# Altium project LTE-GNSS Asset Tracker.PrjPcb (part 1 of 3)
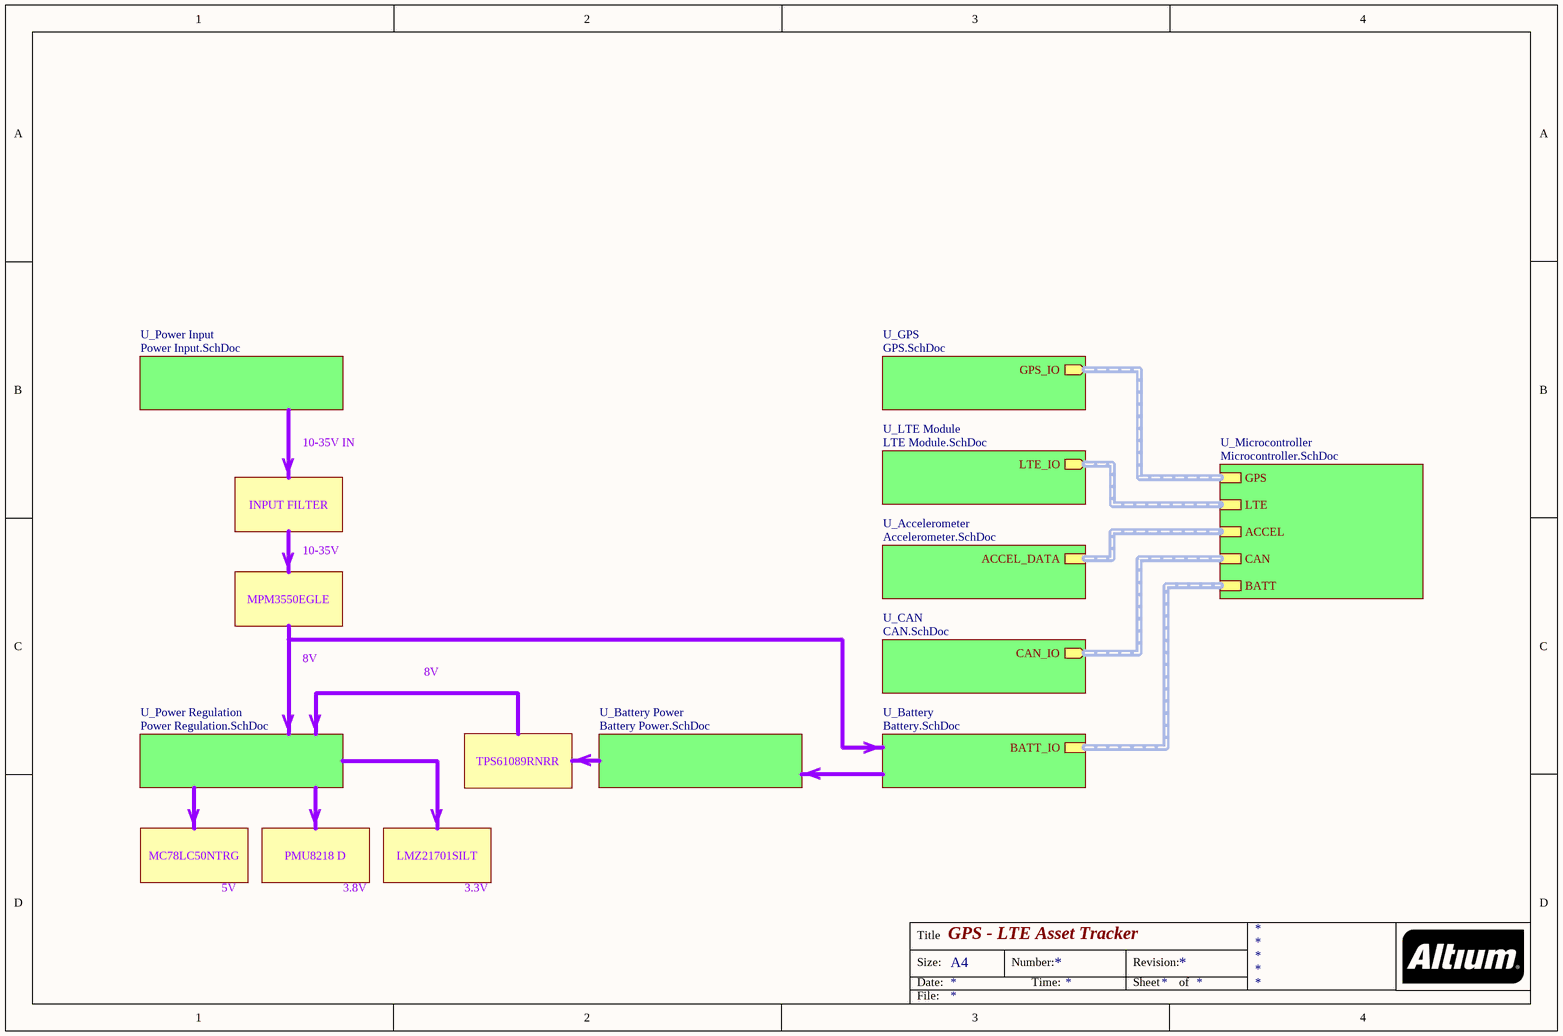
[diagram p0: Top.SchDoc]
10 sheets, 140 parts. Net scope: hierarchical (ports join the sheet entries above them; power ports are global).
Board file: LTE GNSS Tracker.PcbDoc
Sheets:
  Top.SchDoc
    U_Power Regulation = Power Regulation.SchDoc
    U_Power Input = Power Input.SchDoc
    U_Battery = Battery.SchDoc
    U_CAN = CAN.SchDoc
    U_LTE Module = LTE Module.SchDoc
    U_GPS = GPS.SchDoc
    U_Accelerometer = Accelerometer.SchDoc
    U_Battery Power = Battery Power.SchDoc
    U_Microcontroller = Microcontroller.SchDoc

## Sheet Top.SchDoc: GPS - LTE Asset Tracker
size A4; Engineer: Mark Harris

### Sub-sheets
U_Accelerometer = Accelerometer.SchDoc: ACCEL_DATA (harness ACCEL)
U_Battery = Battery.SchDoc: BATT_IO (harness BATT)
U_Battery Power = Battery Power.SchDoc: no entries
U_CAN = CAN.SchDoc: CAN_IO (out, harness CAN)
U_GPS = GPS.SchDoc: GPS_IO (out, harness GPS)
U_LTE Module = LTE Module.SchDoc: LTE_IO (out, harness LTE)
U_Microcontroller = Microcontroller.SchDoc: ACCEL (harness ACCEL), CAN (harness CAN), GPS (harness GPS), LTE (harness LTE), BATT (harness BATT)
U_Power Input = Power Input.SchDoc: no entries
U_Power Regulation = Power Regulation.SchDoc: no entries

### Buses and harness runs
harness sheet U_Accelerometer/ACCEL_DATA = sheet U_Microcontroller/ACCEL
harness sheet U_Battery/BATT_IO = sheet U_Microcontroller/BATT
harness sheet U_CAN/CAN_IO = sheet U_Microcontroller/CAN
harness sheet U_GPS/GPS_IO = sheet U_Microcontroller/GPS
harness sheet U_LTE Module/LTE_IO = sheet U_Microcontroller/LTE

### Notes on the sheet
- 10-35V IN
- INPUT FILTER
- V
- 10-35V
- MPM3550EGLE
- 8V
- TPS61089RNRR
- MC78LC50NTRG
- PMU8218 D
- LMZ21701SILT
- 5V
- 3.8V
- 3.3V
- Title
- Size:
- Date:
- A4
- Number:
- Time:
- Revision:
- Sheet
- of
- File:

## Sheet Power Regulation.SchDoc
size A4
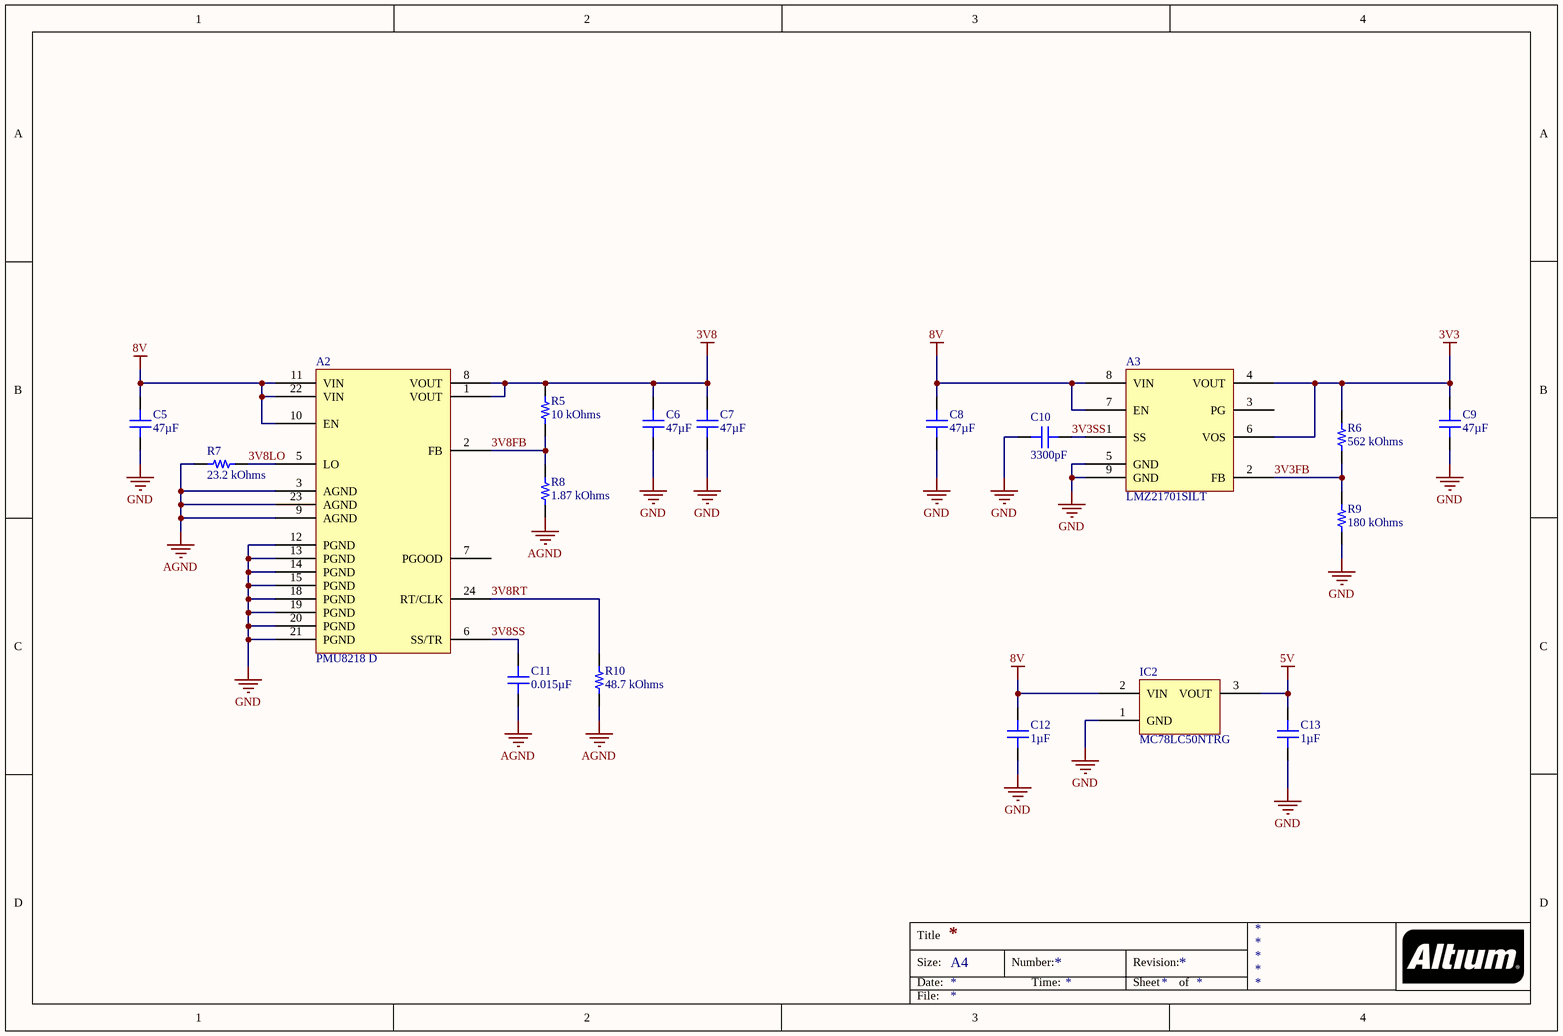
[diagram p1: Power Regulation.SchDoc]

### Parts
A2  PMU8218 D  [FLEX QFM-24 MOL]
A3  LMZ21701SILT  [TI MICROSIP-8 SIL0008E]
C5  47µF  [CAP 1210_3225 - 2.8MM]
C6  47µF  [CAP 1210_3225 - 2.8MM]
C7  47µF  [CAP 1210_3225 - 2.8MM]
C8  47µF  [CAP 1210_3225 - 2.8MM]
C9  47µF  [CAP 1210_3225 - 2.8MM]
C10  3300pF  [CAP 0201_0603]
C11  0.015µF  [CAP 0201_0603]
C12  1µF  [CAP 0402_1005]
C13  1µF  [CAP 0402_1005]
IC2  MC78LC50NTRG  [ON SEMI TSOT-23-5 419AE]
R5  10 kOhms  [RES 0201_0603]
R6  562 kOhms  [RES 0201_0603]
R7  23.2 kOhms  [RES 0201_0603]
R8  1.87 kOhms  [RES 0201_0603]
R9  180 kOhms  [RES 0201_0603]
R10  48.7 kOhms  [RES 0201_0603]

### Nets
3V3: A3.4(VOUT) A3.6(VOS) C9.2 R6.2
3V8: A2.1(VOUT) A2.8(VOUT) C6.2 C7.2 R5.2
5V: C13.2 IC2.3(VOUT)
8V: A2.10(EN) A2.11(VIN) A2.22(VIN) A3.7(EN) A3.8(VIN) C5.2 C8.2 C12.2 IC2.2(VIN)
AGND: A2.3(AGND) A2.9(AGND) A2.23(AGND) C11.1 R7.1 R8.1 R10.1
GND: A2.12(PGND) A2.13(PGND) A2.14(PGND) A2.15(PGND) A2.18(PGND) A2.19(PGND) A2.20(PGND) A2.21(PGND) A3.5(GND) A3.9(GND) C5.1 C6.1 C7.1 C8.1 C9.1 C10.1 C12.1 C13.1 IC2.1(GND) R9.1
3V3FB: A3.2(FB) R6.1 R9.2
3V3SS: A3.1(SS) C10.2
3V8FB: A2.2(FB) R5.1 R8.2
3V8LO: A2.5(LO) R7.2
3V8RT: A2.24(RT/CLK) R10.2
3V8SS: A2.6(SS/TR) C11.2

Not connected (* = marked no-connect by the designer): A2 7(PGOOD); A3 3(PG)

### Notes on the sheet
- Title
- Size:
- Date:
- A4
- Number:
- Time:
- Revision:
- Sheet
- of
- File:

### Library data of the parts
A2 = PMU8218 D: ANALOG POL; 4.5-17VIN; 0.6-5.5VO; Manufacturer: Flex Power Modules; Control Features: Enable, Active High; Current - Output (Max): 4A; Efficiency: 88.5%; Number of Outputs: 1; Power (Watts): 22W; Voltage - Input (Max): 17V; Voltage - Input (Min): 4.5V; Voltage - Output 1: 0.6 ~ 5.5V; Part Number: PMU8218 D; Applications: ITE (Commercial); ComponentLink1Description: Datasheet; ComponentLink1URL: https://flex.com/-/media/Project/Flex/BrandSite/technology/power/power_modules/Analog_POL/FPM-TechSpec-PMU-product-series-RevB.pdf; ComponentLink2Description: DigiKey Link; ComponentLink2URL: http://digikey.com/product-detail/en/flex-power-modules/PMU8218-D/2166-PMU8218DCT-ND/11581978; Device Package: 24-SMD Module; Features: Adjustable Output, Remote On/Off; LastUpdated: 04/04/2020 18:59:44; Lifecycle Status: Active; Minimum Order: 1; Mounting Type: Surface Mount; Operating Temperature: -40°C ~ 125°C; Package / Case: 24-SMD Module; Packaging: Unknown; PartId: 24; Part Status: Active; Price: 4.46; Series: PMU8000; Size / Dimension: 0.30" L x 0.30" W x 0.21" H (7.5mm x 7.5mm x 5.4mm); Supplier 1: DigiKey; Supplier Part Number 1: 2166-PMU8218DCT-ND; Type: Non-Isolated PoL Module
A3 = LMZ21701SILT: DC DC CONVERTER 0.9-6V 6W; Manufacturer: Texas Instruments; Control Features: Enable, Active High; Current - Output (Max): 1A; Efficiency: 95%; Number of Outputs: 1; Voltage - Input (Max): 17V; Voltage - Input (Min): 3V; Voltage - Output 1: 0.9 ~ 6V; Part Number: LMZ21701SILT; Applications: ITE (Commercial); ComponentLink1Description: Datasheet; ComponentLink1URL: http://www.ti.com/general/docs/suppproductinfo.tsp?distId=10&gotoUrl=http%3A%2F%2Fwww.ti.com%2Flit%2Fgpn%2Flmz21701; ComponentLink2Description: DigiKey Link; ComponentLink2URL: //digikey.com/product-detail/en/texas-instruments/LMZ21701SILT/296-38545-2-ND/5034142; Device Package: 8-SMD Module; Features: OCP, OTP, SCP, UVLO; LastUpdated: 12/12/2019 07:43:20; Lifecycle Status: 0; Minimum Order: 1; Mounting Type: Surface Mount; Operating Temperature: -40°C ~ 125°C; Package / Case: 8-SMD Module; Packaging: TapeAndReel; PartId: 15; Part Status: Active; Price: 2.94; Series: SIMPLE SWITCHER® Nano; Size / Dimension: 0.14" L x 0.14" W x 0.07" H (3.5mm x 3.5mm x 1.8mm); Supplier 1: DigiKey; Supplier Part Number 1: 296-38545-2-ND; Type: Non-Isolated PoL Module
C5-C9 = LMK325B7476MM-PR: CAP CER 47UF 10V X7R 1210; Manufacturer: Taiyo Yuden; Tolerance: ±20%; Part Number: LMK325B7476MM-PR; Value: 47µF; Applications: General Purpose; Capacitance: 47µF; ComponentLink1Description: Datasheet; ComponentLink1URL: https://www.yuden.co.jp/productdata/catalog/mlcc01_e.pdf; ComponentLink2Description: DigiKey Link; ComponentLink2URL: http://digikey.com/product-detail/en/taiyo-yuden/LMK325B7476MM-PR/587-5922-1-ND/7675042; Device Package: 1210 (3225 Metric); LastUpdated: 21/01/2020 00:30:21; Lifecycle Status: Active; Minimum Order: 1; Mounting Type: Surface Mount, MLCC; Operating Temperature: -55°C ~ 125°C; Package / Case: 1210 (3225 Metric); Packaging: TapeAndReel; PartId: 24091; Part Status: Active; Price: 0.28; Series: M; Size / Dimension: 0.126" L x 0.098" W (3.20mm x 2.50mm); Supplier 1: DigiKey; Supplier Part Number 1: 587-5922-1-ND; Temperature Coefficient: X7R; Thickness (Max): 0.106" (2.70mm); Voltage - Rated: 10V
C10 = GRM033R70J332KA01D: CAP CER 3300PF 6.3V X7R 0201; Manufacturer: Murata Electronics; Tolerance: ±10%; Part Number: GRM033R70J332KA01D; Value: 3300pF; Applications: General Purpose; Capacitance: 3300pF; ComponentLink1Description: Datasheet; ComponentLink1URL: https://www.murata.com/~/media/webrenewal/support/library/catalog/products/capacitor/mlcc/c02e.ashx?la=en-us; ComponentLink2Description: DigiKey Link; ComponentLink2URL: http://digikey.com/product-detail/en/murata-electronics/GRM033R70J332KA01D/490-8158-1-ND/4380451; Device Package: 0201 (0603 Metric); LastUpdated: 21/01/2020 00:00:13; Lifecycle Status: Active; Minimum Order: 1; Mounting Type: Surface Mount, MLCC; Operating Temperature: -55°C ~ 125°C; Package / Case: 0201 (0603 Metric); Packaging: CutTape; PartId: 1379; Part Status: Active; Price: 0.10; Series: GRM; Size / Dimension: 0.024" L x 0.012" W (0.60mm x 0.30mm); Supplier 1: DigiKey; Supplier Part Number 1: 490-8158-1-ND; Temperature Coefficient: X7R; Thickness (Max): 0.013" (0.33mm); Voltage - Rated: 6.3V
C11 = CC0201KRX5R5BB153: CAP CER 0.015UF 6.3V X5R 0201; Manufacturer: Yageo; Tolerance: ±10%; Part Number: CC0201KRX5R5BB153; Value: 0.015µF; Applications: General Purpose; Capacitance: 0.015µF; ComponentLink1Description: Datasheet; ComponentLink1URL: https://www.yageo.com/upload/media/product/productsearch/datasheet/mlcc/UPY-GPHC_X5R_4V-to-50V_25.pdf; ComponentLink2Description: DigiKey Link; ComponentLink2URL: http://digikey.com/product-detail/en/yageo/CC0201KRX5R5BB153/311-3686-1-ND/8024775; Device Package: 0201 (0603 Metric); LastUpdated: 21/01/2020 00:00:12; Lifecycle Status: Active; Minimum Order: 1; Mounting Type: Surface Mount, MLCC; Operating Temperature: -55°C ~ 85°C; Package / Case: 0201 (0603 Metric); Packaging: TapeAndReel; PartId: 1637; Part Status: Active; Price: 0.01; Series: CC; Size / Dimension: 0.024" L x 0.012" W (0.60mm x 0.30mm); Supplier 1: DigiKey; Supplier Part Number 1: 311-3686-1-ND; Temperature Coefficient: X5R; Thickness (Max): 0.013" (0.33mm); Voltage - Rated: 6.3V
C12 C13 = GRM155R61C105MA12D: CAP CER 1UF 16V X5R 0402; Manufacturer: Murata Electronics; Tolerance: ±20%; Part Number: GRM155R61C105MA12D; Value: 1µF; Applications: General Purpose; Capacitance: 1µF; ComponentLink1Description: Datasheet; ComponentLink1URL: https://search.murata.co.jp/Ceramy/image/img/A01X/G101/ENG/GRM155R61C105MA12-01.pdf; ComponentLink2Description: DigiKey Link; ComponentLink2URL: http://digikey.com/product-detail/en/murata-electronics/GRM155R61C105MA12D/490-14599-1-ND/6606205; Device Package: 0402 (1005 Metric); LastUpdated: 01/04/2020 23:56:41; Lifecycle Status: Active; Minimum Order: 1; Mounting Type: Surface Mount, MLCC; Operating Temperature: -55°C ~ 85°C; Package / Case: 0402 (1005 Metric); Packaging: TapeAndReel; PartId: 10295; Part Status: Active; Price: 0.01; Series: GRM; Size / Dimension: 0.039" L x 0.020" W (1.00mm x 0.50mm); Supplier 1: DigiKey; Supplier Part Number 1: 490-14599-1-ND; Temperature Coefficient: X5R; Thickness (Max): 0.022" (0.55mm); Voltage - Rated: 16V
IC2 = MC78LC50NTRG: IC REG LINEAR 5V 100MA 5TSOP; Manufacturer: ON Semiconductor; Current - Quiescent (Iq): 3.6µA; Number of Regulators: 1; Output Configuration: Positive; Output Type: Fixed; Voltage Dropout (Max): 0.038V @ 1mA; Voltage - Input (Max): 12V; Part Number: MC78LC50NTRG; ComponentLink1Description: Datasheet; ComponentLink1URL: http://www.onsemi.com/pub/Collateral/MC78LC00-D.PDF; ComponentLink2Description: DigiKey Link; ComponentLink2URL: http://digikey.com/product-detail/en/on-semiconductor/MC78LC50NTRG/MC78LC50NTRGOSCT-ND/1139754; Current - Output: 100mA; Device Package: SOT-23-5 Thin, TSOT-23-5; LastUpdated: 21/01/2020 03:58:44; Lifecycle Status: Active; Minimum Order: 1; Mounting Type: Surface Mount; Operating Temperature: -40°C ~ 85°C; Package / Case: SOT-23-5 Thin, TSOT-23-5; Packaging: TapeAndReel; Part Status: Active; Price: 0.28; Series: -; Supplier 1: DigiKey; Supplier Part Number 1: MC78LC50NTRGOSCT-ND; Supplier Device Package: 5-TSOP; Voltage - Output (Min/Fixed): 5V
R5 = ERJ-1GNF1002C: RES SMD 10K OHM 1% 1/20W 0201; Manufacturer: Panasonic Electronic Components; Power (Watts): 0.05W, 1/20W; Temperature Coefficient: ±200ppm/°C; Part Number: ERJ-1GNF1002C; Value: 10 kOhms; ComponentLink1Description: Datasheet; ComponentLink1URL: https://industrial.panasonic.com/cdbs/www-data/pdf/RDA0000/AOA0000C304.pdf; ComponentLink2Description: DigiKey Link; ComponentLink2URL: http://digikey.com/product-detail/en/panasonic-electronic-components/ERJ-1GNF1002C/P122414CT-ND/7389440; Composition: Thick Film; Device Package: 0201 (0603 Metric); Features: Automotive AEC-Q200; Height - Seated (Max): 0.010" (0.26mm); LastUpdated: 21/01/2020 00:04:13; Lifecycle Status: Active; Minimum Order: 1; Number of Terminations: 2; Operating Temperature: -55°C ~ 125°C; Package / Case: 0201 (0603 Metric); Packaging: TapeAndReel; PartId: 2296; Part Status: Active; Price: 0.01; Ratings: AEC-Q200; Resistance: 10 kOhms; Series: ERJ; Size / Dimension: 0.024" L x 0.012" W (0.60mm x 0.30mm); Supplier 1: DigiKey; Supplier Part Number 1: P122414CT-ND; Supplier Device Package: 0201; Tolerance: ±1%
R6 = ERJ-1GNF5623C: RES SMD 562K OHM 1% 1/20W 0201; Manufacturer: Panasonic Electronic Components; Power (Watts): 0.05W, 1/20W; Temperature Coefficient: ±200ppm/°C; Part Number: ERJ-1GNF5623C; Value: 562 kOhms; ComponentLink1Description: Datasheet; ComponentLink1URL: https://industrial.panasonic.com/cdbs/www-data/pdf/RDA0000/AOA0000C304.pdf; ComponentLink2Description: DigiKey Link; ComponentLink2URL: http://digikey.com/product-detail/en/panasonic-electronic-components/ERJ-1GNF5623C/P123081CT-ND/8343101; Composition: Thick Film; Device Package: 0201 (0603 Metric); Features: Automotive AEC-Q200; Height - Seated (Max): 0.010" (0.26mm); LastUpdated: 21/01/2020 00:04:13; Lifecycle Status: Active; Minimum Order: 1; Number of Terminations: 2; Operating Temperature: -55°C ~ 125°C; Package / Case: 0201 (0603 Metric); Packaging: TapeAndReel; PartId: 2605; Part Status: Active; Price: 0.01; Ratings: AEC-Q200; Resistance: 562 kOhms; Series: ERJ; Size / Dimension: 0.024" L x 0.012" W (0.60mm x 0.30mm); Supplier 1: DigiKey; Supplier Part Number 1: P123081CT-ND; Supplier Device Package: 0201; Tolerance: ±1%
R7 = ERJ-1GNF2322C: RES SMD 23.2K OHM 1% 1/20W 0201; Manufacturer: Panasonic Electronic Components; Power (Watts): 0.05W, 1/20W; Temperature Coefficient: ±200ppm/°C; Part Number: ERJ-1GNF2322C; Value: 23.2 kOhms; ComponentLink1Description: Datasheet; ComponentLink1URL: https://industrial.panasonic.com/cdbs/www-data/pdf/RDA0000/AOA0000C304.pdf; ComponentLink2Description: DigiKey Link; ComponentLink2URL: http://digikey.com/product-detail/en/panasonic-electronic-components/ERJ-1GNF2322C/P122848CT-ND/8342635; Composition: Thick Film; Device Package: 0201 (0603 Metric); Features: Automotive AEC-Q200; Height - Seated (Max): 0.010" (0.26mm); LastUpdated: 21/01/2020 00:04:13; Lifecycle Status: Active; Minimum Order: 1; Number of Terminations: 2; Operating Temperature: -55°C ~ 125°C; Package / Case: 0201 (0603 Metric); Packaging: TapeAndReel; PartId: 2324; Part Status: Active; Price: 0.01; Ratings: AEC-Q200; Resistance: 23.2 kOhms; Series: ERJ; Size / Dimension: 0.024" L x 0.012" W (0.60mm x 0.30mm); Supplier 1: DigiKey; Supplier Part Number 1: P122848CT-ND; Supplier Device Package: 0201; Tolerance: ±1%
R8 = ERJ-1GNF1871C: RES SMD 1.87K OHM 1% 1/20W 0201; Manufacturer: Panasonic Electronic Components; Power (Watts): 0.05W, 1/20W; Temperature Coefficient: ±200ppm/°C; Part Number: ERJ-1GNF1871C; Value: 1.87 kOhms; ComponentLink1Description: Datasheet; ComponentLink1URL: https://industrial.panasonic.com/cdbs/www-data/pdf/RDA0000/AOA0000C304.pdf; ComponentLink2Description: DigiKey Link; ComponentLink2URL: http://digikey.com/product-detail/en/panasonic-electronic-components/ERJ-1GNF1871C/P122796CT-ND/8342531; Composition: Thick Film; Device Package: 0201 (0603 Metric); Features: Automotive AEC-Q200; Height - Seated (Max): 0.010" (0.26mm); LastUpdated: 21/01/2020 00:04:11; Lifecycle Status: Active; Minimum Order: 1; Number of Terminations: 2; Operating Temperature: -55°C ~ 125°C; Package / Case: 0201 (0603 Metric); Packaging: TapeAndReel; PartId: 3542; Part Status: Active; Price: 0.01; Ratings: AEC-Q200; Resistance: 1.87 kOhms; Series: ERJ; Size / Dimension: 0.024" L x 0.012" W (0.60mm x 0.30mm); Supplier 1: DigiKey; Supplier Part Number 1: P122796CT-ND; Supplier Device Package: 0201; Tolerance: ±1%
R9 = ERJ-1GNF1803C: RES SMD 180K OHM 1% 1/20W 0201; Manufacturer: Panasonic Electronic Components; Power (Watts): 0.05W, 1/20W; Temperature Coefficient: ±200ppm/°C; Part Number: ERJ-1GNF1803C; Value: 180 kOhms; ComponentLink1Description: Datasheet; ComponentLink1URL: https://industrial.panasonic.com/cdbs/www-data/pdf/RDA0000/AOA0000C304.pdf; ComponentLink2Description: DigiKey Link; ComponentLink2URL: http://digikey.com/product-detail/en/panasonic-electronic-components/ERJ-1GNF1803C/P122790CT-ND/8342519; Composition: Thick Film; Device Package: 0201 (0603 Metric); Features: Automotive AEC-Q200; Height - Seated (Max): 0.010" (0.26mm); LastUpdated: 21/01/2020 00:04:10; Lifecycle Status: Active; Minimum Order: 1; Number of Terminations: 2; Operating Temperature: -55°C ~ 125°C; Package / Case: 0201 (0603 Metric); Packaging: TapeAndReel; PartId: 4229; Part Status: Active; Price: 0.01; Ratings: AEC-Q200; Resistance: 180 kOhms; Series: ERJ; Size / Dimension: 0.024" L x 0.012" W (0.60mm x 0.30mm); Supplier 1: DigiKey; Supplier Part Number 1: P122790CT-ND; Supplier Device Package: 0201; Tolerance: ±1%
R10 = ERJ-1GNF4872C: RES SMD 48.7K OHM 1% 1/20W 0201; Manufacturer: Panasonic Electronic Components; Power (Watts): 0.05W, 1/20W; Temperature Coefficient: ±200ppm/°C; Part Number: ERJ-1GNF4872C; Value: 48.7 kOhms; ComponentLink1Description: Datasheet; ComponentLink1URL: https://industrial.panasonic.com/cdbs/www-data/pdf/RDA0000/AOA0000C304.pdf; ComponentLink2Description: DigiKey Link; ComponentLink2URL: http://digikey.com/product-detail/en/panasonic-electronic-components/ERJ-1GNF4872C/P123042CT-ND/8343023; Composition: Thick Film; Device Package: 0201 (0603 Metric); Features: Automotive AEC-Q200; Height - Seated (Max): 0.010" (0.26mm); LastUpdated: 21/01/2020 00:04:10; Lifecycle Status: Active; Minimum Order: 1; Number of Terminations: 2; Operating Temperature: -55°C ~ 125°C; Package / Case: 0201 (0603 Metric); Packaging: TapeAndReel; PartId: 4173; Part Status: Active; Price: 0.01; Ratings: AEC-Q200; Resistance: 48.7 kOhms; Series: ERJ; Size / Dimension: 0.024" L x 0.012" W (0.60mm x 0.30mm); Supplier 1: DigiKey; Supplier Part Number 1: P123042CT-ND; Supplier Device Package: 0201; Tolerance: ±1%

## Sheet Power Input.SchDoc
size A4
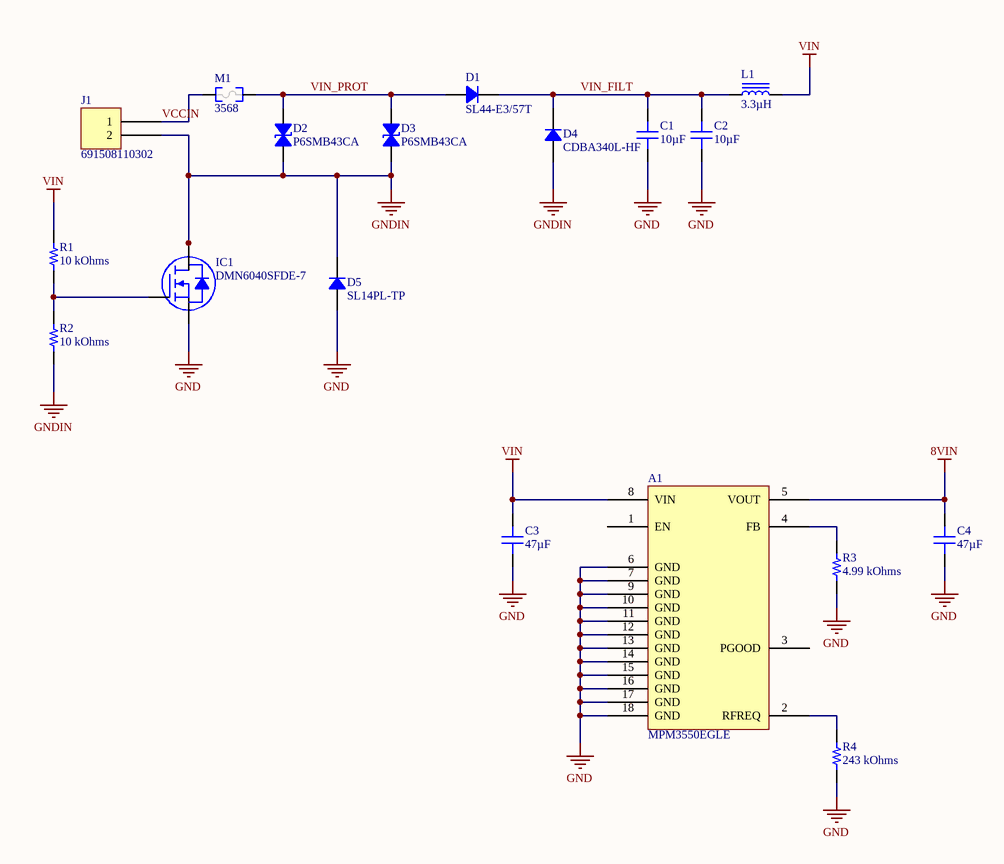
[diagram p2: Power Input.SchDoc]

### Parts
A1  MPM3550EGLE  [MPS LGA-18 12x12x4.2mm]
C1  10µF  [CAP 1210_3225 - 2.8MM]
C2  10µF  [CAP 1210_3225 - 2.8MM]
C3  47µF  [CAP 1210_3225 - 2.8MM]
C4  47µF  [CAP 1210_3225 - 2.8MM]
D1  SL44-E3/57T  [DO214AB SMC]
D2  P6SMB43CA  [DO214AA SMB]
D3  P6SMB43CA  [DO214AA SMB]
D4  CDBA340L-HF  [DO214AC SMA]
D5  SL14PL-TP  [SOD123F]
IC1  DMN6040SFDE-7  [DIODES U-DFN2020-6E]
J1  691508110302  [WURTH 691508110302]
L1  3.3µH  [BOURNS SRP5030T]
M1  3568  [KEYSTONE 3568]
R1  10 kOhms  [RES 0201_0603]
R2  10 kOhms  [RES 0201_0603]
R3  4.99 kOhms  [RES 0201_0603]
R4  243 kOhms  [RES 0201_0603]

### Nets
8VIN: A1.5(VOUT) C4.2
GND: A1.6(GND) A1.7(GND) A1.9(GND) A1.10(GND) A1.11(GND) A1.12(GND) A1.13(GND) A1.14(GND) A1.15(GND) A1.16(GND) A1.17(GND) A1.18(GND) C1.1 C2.1 C3.1 C4.1 D5.1 IC1.S R3.1 R4.1
GNDIN: D2.1 D3.1 D4.1 D5.2 IC1.D(Drain) J1.2 R2.1
VIN: A1.8(VIN) C3.2 L1.2 R1.1
VCCIN: J1.1 M1.1
VIN_FILT: C1.2 C2.2 D1.2 D4.2 L1.1
VIN_PROT: D1.1 D2.2 D3.2 M1.2
NetA1_2: A1.2(RFREQ) R4.2
NetA1_4: A1.4(FB) R3.2
NetIC1_G: IC1.G R1.2 R2.2

Not connected (* = marked no-connect by the designer): A1 1(EN) 3(PGOOD)

### Notes on the sheet
- Title
- Size:
- Date:
- A4
- Number:
- Time:
- Revision:
- Sheet
- of
- File:

### Library data of the parts
A1 = MPM3550EGLE: DC/DC POWER MODULE 5A 1.0 TO 12.; Manufacturer: Monolithic Power Systems Inc.; Efficiency: 94.6%; Number of Outputs: 1; Voltage - Input (Max): 36V; Voltage - Input (Min): 4.5V; Voltage - Output 1: 1 ~ 12V; Part Number: MPM3550EGLE; Applications: ITE (Commercial); ComponentLink1Description: Datasheet; ComponentLink1URL: https://www.monolithicpower.com/en/documentview/productdocument/index/doc_url/L20vcC9tcG0zNTUwZV9yMS4wLnBkZg/prod_id/MzE5Ng/; ComponentLink2Description: DigiKey Link; ComponentLink2URL: http://digikey.com/product-detail/en/monolithic-power-systems-inc/MPM3550EGLE/1589-2043-ND/10223607; Current - Output (Max): 5A; Device Package: 18-BLGA Module; Features: OCP, OTP, SCP, UVLO; LastUpdated: 05/04/2020 00:28:48; Lifecycle Status: Active; Minimum Order: 1; Mounting Type: Surface Mount; Operating Temperature: -40°C ~ 125°C; Package / Case: 18-BLGA Module; Packaging: Unknown; PartId: 26; Part Status: Active; Price: 9.16; Series: -; Size / Dimension: 0.47" L x 0.47" W x 0.17" H (12.0mm x 12.0mm x 4.2mm); Supplier 1: DigiKey; Supplier Part Number 1: 1589-2043-ND; Supplier Device Package: 18-LGA (12x12); Type: Non-Isolated PoL Module
C1 C2 = CL32B106KBJNNNE: CAP CER 10UF 50V X7R 1210; Manufacturer: Samsung Electro-Mechanics; Tolerance: ±10%; Part Number: CL32B106KBJNNNE; Value: 10µF; Applications: General Purpose; Capacitance: 10µF; ComponentLink1Description: Datasheet; ComponentLink1URL: http://www.samsungsem.com/kr/support/product-search/mlcc/CL32B106KBJNNNE .jsp; ComponentLink2Description: DigiKey Link; ComponentLink2URL: http://digikey.com/product-detail/en/samsung-electro-mechanics/CL32B106KBJNNNE/1276-3387-1-ND/3891473; Device Package: 1210 (3225 Metric); LastUpdated: 21/01/2020 00:30:21; Lifecycle Status: Active; Minimum Order: 1; Mounting Type: Surface Mount, MLCC; Operating Temperature: -55°C ~ 125°C; Package / Case: 1210 (3225 Metric); Packaging: TapeAndReel; PartId: 24115; Part Status: Active; Price: 0.17; Series: CL; Size / Dimension: 0.126" L x 0.098" W (3.20mm x 2.50mm); Supplier 1: DigiKey; Supplier Part Number 1: 1276-3387-1-ND; Temperature Coefficient: X7R; Thickness (Max): 0.106" (2.70mm); Voltage - Rated: 50V
C3 C4 = LMK325B7476MM-PR: as C5 on sheet Power Regulation; Part Number: LMK325B7476MM-PR; Value: 47µF; Applications: General Purpose; Capacitance: 47µF; ComponentLink1Description: Datasheet; ComponentLink1URL: https://www.yuden.co.jp/productdata/catalog/mlcc01_e.pdf; ComponentLink2Description: DigiKey Link; ComponentLink2URL: http://digikey.com/product-detail/en/taiyo-yuden/LMK325B7476MM-PR/587-5922-1-ND/7675042; Device Package: 1210 (3225 Metric); LastUpdated: 21/01/2020 00:30:21; Lifecycle Status: Active; Minimum Order: 1; Mounting Type: Surface Mount, MLCC; Operating Temperature: -55°C ~ 125°C; Package / Case: 1210 (3225 Metric); Packaging: TapeAndReel; PartId: 24091; Part Status: Active; Price: 0.28; Series: M; Size / Dimension: 0.126" L x 0.098" W (3.20mm x 2.50mm); Supplier 1: DigiKey; Supplier Part Number 1: 587-5922-1-ND; Temperature Coefficient: X7R; Thickness (Max): 0.106" (2.70mm); Voltage - Rated: 10V
D1 = SL44-E3/57T: DIODE SCHOTTKY 40V 4A DO214AB; Manufacturer: Vishay Semiconductor Diodes Division; Current - Reverse Leakage @ Vr: 500µA @ 40V; Speed: Fast Recovery =< 500ns, > 200mA (Io); Voltage - Forward (Vf) (Max) @ If: 440mV @ 4A; Part Number: SL44-E3/57T; ComponentLink1Description: Datasheet; ComponentLink1URL: http://www.vishay.com/docs/88742/sl42.pdf; ComponentLink2Description: DigiKey Link; ComponentLink2URL: http://digikey.com/product-detail/en/vishay-semiconductor-diodes-division/SL44-E3-57T/SL44-E3-57TGICT-ND/1091623; Current - Average Rectified (Io): 4A; Device Package: DO-214AB, SMC; Diode Type: Schottky; LastUpdated: 21/01/2020 02:38:50; Lifecycle Status: Active; Minimum Order: 1; Mounting Type: Surface Mount; Operating Temperature - Junction: -55°C ~ 125°C; Package / Case: DO-214AB, SMC; Packaging: TapeAndReel; PartId: 1768; Part Status: Active; Price: 0.42; Series: -; Supplier 1: DigiKey; Supplier Part Number 1: SL44-E3/57TGICT-ND; Supplier Device Package: DO-214AB (SMC); Voltage - DC Reverse (Vr) (Max): 40V
D2 D3 = P6SMB43CA: TVS DIODE 36.8V 59.3V DO214AA; Manufacturer: Bourns Inc.; Bidirectional Channels: 1; Current - Peak Pulse (10/1000µs): 10.3A; Power Line Protection: No; Power - Peak Pulse: 600W; Type: Zener; Voltage - Breakdown (Min): 40.9V; Part Number: P6SMB43CA; Applications: General Purpose; ComponentLink1Description: Datasheet; ComponentLink1URL: https://www.bourns.com/docs/Product-Datasheets/P6SMB.pdf; ComponentLink2Description: DigiKey Link; ComponentLink2URL: http://digikey.com/product-detail/en/bourns-inc/P6SMB43CA/P6SMB43CABBCT-ND/6708253; Device Package: DO-214AA, SMB; LastUpdated: 21/03/2020 01:01:48; Lifecycle Status: Active; Minimum Order: 1; Mounting Type: Surface Mount; Operating Temperature: -55°C ~ 150°C (TJ); Package / Case: DO-214AA, SMB; Packaging: TapeAndReel; PartId: 8863; Part Status: Active; Price: 0.11; Series: -; Supplier 1: DigiKey; Supplier Part Number 1: P6SMB43CABBCT-ND; Supplier Device Package: DO-214AA (SMB); Voltage - Clamping (Max) @ Ipp: 59.3V; Voltage - Reverse Standoff (Typ): 36.8V
D4 = CDBA340L-HF: DIODE SCHOTTKY 40V 3A DO214AC; Manufacturer: Comchip Technology; Capacitance @ Vr, F: 300pF @ 4V, 1MHz; Current - Average Rectified (Io): 3A (DC); Current - Reverse Leakage @ Vr: 1mA @ 40V; Speed: Fast Recovery =< 500ns, > 200mA (Io); Voltage - Forward (Vf) (Max) @ If: 400mV @ 3A; Part Number: CDBA340L-HF; ComponentLink1Description: Datasheet; ComponentLink1URL: http://www.comchiptech.com/admin/files/product/CDBA340L-HF%20RevC514368.pdf; ComponentLink2Description: DigiKey Link; ComponentLink2URL: http://digikey.com/product-detail/en/comchip-technology/CDBA340L-HF/641-1702-1-ND/5226085; Device Package: DO-214AC, SMA; Diode Type: Schottky; LastUpdated: 02/02/2020 10:17:41; Lifecycle Status: Active; Minimum Order: 1; Mounting Type: Surface Mount; Operating Temperature - Junction: -50°C ~ 100°C; Package / Case: DO-214AC, SMA; Packaging: TapeAndReel; PartId: 1972; Part Status: Active; Price: 0.20; Series: -; Supplier 1: DigiKey; Supplier Part Number 1: 641-1702-1-ND; Supplier Device Package: DO-214AC (SMA); Voltage - DC Reverse (Vr) (Max): 40V
D5 = SL14PL-TP: DIODE SCHOTTKY 1A 40V SOD-123FL; Manufacturer: Micro Commercial Co; Current - Reverse Leakage @ Vr: 500µA @ 40V; Speed: Fast Recovery =< 500ns, > 200mA (Io); Voltage - Forward (Vf) (Max) @ If: 400mV @ 1A; Part Number: SL14PL-TP; ComponentLink1Description: Datasheet; ComponentLink1URL: https://www.mccsemi.com/pdf/Products/SL14PL-SL110PL(SOD-123FL)-B.pdf; ComponentLink2Description: DigiKey Link; ComponentLink2URL: http://digikey.com/product-detail/en/micro-commercial-co/SL14PL-TP/SL14PL-TPMSCT-ND/7681629; Current - Average Rectified (Io): 1A; Device Package: SOD-123F; Diode Type: Schottky; LastUpdated: 21/01/2020 02:43:49; Lifecycle Status: Active; Minimum Order: 1; Mounting Type: Surface Mount; Operating Temperature - Junction: -55°C ~ 150°C; Package / Case: SOD-123F; Packaging: TapeAndReel; PartId: 2344; Part Status: Active; Price: 0.06; Series: -; Supplier 1: DigiKey; Supplier Part Number 1: SL14PL-TPMSCT-ND; Supplier Device Package: SOD-123FL; Voltage - DC Reverse (Vr) (Max): 40V
IC1 = DMN6040SFDE-7: MOSFET N-CH 60V 5.3A U-DFN; Manufacturer: Diodes Incorporated; Current - Continuous Drain (Id) @ 25°C: 5.3A (Ta); Drive Voltage (Max Rds On,  Min Rds On): 4.5V, 10V; FET Type: N-Channel; Gate Charge (Qg) (Max) @ Vgs: 22.4nC @ 10V; Input Capacitance (Ciss) (Max) @ Vds: 1287pF @ 25V; Power Dissipation (Max): 660mW (Ta); Rds On (Max) @ Id, Vgs: 38mOhm @ 4.3A, 10V; Vgs (Max): ±20V; Vgs(th) (Max) @ Id: 3V @ 250µA; Part Number: DMN6040SFDE-7; ComponentLink1Description: Datasheet; ComponentLink1URL: https://www.diodes.com/assets/Datasheets/DMN6040SFDE.pdf; ComponentLink2Description: DigiKey Link; ComponentLink2URL: http://digikey.com/product-detail/en/diodes-incorporated/DMN6040SFDE-7/DMN6040SFDE-7DICT-ND/3451573; Device Package: 6-UDFN Exposed Pad; Drain to Source Voltage (Vdss): 60V; LastUpdated: 30/03/2020 13:01:59; Lifecycle Status: Active; Minimum Order: 1; Mounting Type: Surface Mount; Operating Temperature: -55°C ~ 150°C (TJ); Package / Case: 6-UDFN Exposed Pad; Packaging: TapeAndReel; Part Status: Active; Price: 0.20; Series: -; Supplier 1: DigiKey; Supplier Part Number 1: DMN6040SFDE-7DICT-ND; Supplier Device Package: U-DFN2020-6 (Type E); Technology: MOSFET (Metal Oxide)
J1 = 691508110302: TERM BLOCK 2POS 3.5MM SMD; Manufacturer: Würth Elektronik; Current: 10A; Mating Orientation: Horizontal and Vertical with Board; Number of Levels: 1; Pitch: 0.138" (3.50mm); Positions Per Level: 2; Voltage: 300V; Wire Gauge: 16-30 AWG; Wire Termination: Screw - Rising Cage Clamp; Part Number: 691508110302; Color: Black; ComponentLink1Description: Datasheet; ComponentLink1URL: https://katalog.we-online.de/em/datasheet/6915081103xx.pdf; ComponentLink2Description: DigiKey Link; ComponentLink2URL: http://digikey.com/product-detail/en/w-rth-elektronik/691508110302/732-5963-1-ND/5047612; Features: Board Guide, Mounting Flange; LastUpdated: 15/01/2020 04:18:55; Lifecycle Status: Active; Minimum Order: 1; Mounting Type: Surface Mount; Packaging: TapeAndReel; Part Status: Active; Price: 1.57; Series: WR-TBL Series 5081; Supplier 1: DigiKey; Supplier Part Number 1: 732-5963-1-ND
L1 = SRP5030T-3R3M: FIXED IND 3.3UH 5A 38 MOHM SMD; Manufacturer: Bourns Inc.; Current - Saturation: 8A; DC Resistance (DCR): 38mOhm Max; Inductance Frequency - Test: 100kHz; Material - Core: Iron Powder; Shielding: Shielded; Tolerance: ±20%; Type: Wirewound; Part Number: SRP5030T-3R3M; ComponentLink1Description: Datasheet; ComponentLink1URL: https://www.bourns.com/docs/Product-Datasheets/SRP5030T.pdf; ComponentLink2Description: DigiKey Link; ComponentLink2URL: http://digikey.com/product-detail/en/bourns-inc/SRP5030T-3R3M/SRP5030T-3R3MCT-ND/3986025; Current Rating (Amps): 5A; Device Package: Nonstandard; Height - Seated (Max): 0.118" (3.00mm); Inductance: 3.3µH; LastUpdated: 21/01/2020 03:25:23; Lifecycle Status: Active; Minimum Order: 1; Mounting Type: Surface Mount; Operating Temperature: -40°C ~ 125°C; Package / Case: Nonstandard; Packaging: TapeAndReel; PartId: 6; Part Status: Active; Price: 0.66; Series: SRP5030T; Size / Dimension: 0.224" L x 0.205" W (5.70mm x 5.20mm); Supplier 1: DigiKey; Supplier Part Number 1: SRP5030T-3R3MCT-ND; Value: 3.3µH
M1 = 3568: FUSE HOLDER BLADE 500V 30A PCB; Manufacturer: Keystone Electronics; For Use With/Related Products: MINI ATC, MINI ATO; Fuse Size: 0.43" L x 0.15" W x 0.347" H (10.92mm x 3.81mm x 8.81mm); Number of Circuits: 1; Part Number: 3568; ComponentLink1Description: Datasheet; ComponentLink1URL: http://keyelco.com/userAssets/file/M65p42.pdf; ComponentLink2Description: DigiKey Link; ComponentLink2URL: http://digikey.com/product-detail/en/keystone-electronics/3568/36-3568-ND/2137306; Contact Finish: Tin; Contact Material: Brass; Current Rating (Amps): 30A; Fuseholder Type: Holder; Fuse Type: Blade; LastUpdated: 05/04/2020 19:02:49; Lifecycle Status: Active; Minimum Order: 1; Mounting Type: Through Hole; Orientation: Vertical; Packaging: Unknown; Part Status: Active; Price: 1.03; Series: MINI® 297; Supplier 1: DigiKey; Supplier Part Number 1: 36-3568-ND; Termination Style: PC Pin; Voltage: 500V
R1 R2 = ERJ-1GNF1002C: as R5 on sheet Power Regulation; Part Number: ERJ-1GNF1002C; Value: 10 kOhms; ComponentLink1Description: Datasheet; ComponentLink1URL: https://industrial.panasonic.com/cdbs/www-data/pdf/RDA0000/AOA0000C304.pdf; ComponentLink2Description: DigiKey Link; ComponentLink2URL: http://digikey.com/product-detail/en/panasonic-electronic-components/ERJ-1GNF1002C/P122414CT-ND/7389440; Composition: Thick Film; Device Package: 0201 (0603 Metric); Features: Automotive AEC-Q200; Height - Seated (Max): 0.010" (0.26mm); LastUpdated: 21/01/2020 00:04:13; Lifecycle Status: Active; Minimum Order: 1; Number of Terminations: 2; Operating Temperature: -55°C ~ 125°C; Package / Case: 0201 (0603 Metric); Packaging: TapeAndReel; PartId: 2296; Part Status: Active; Price: 0.01; Ratings: AEC-Q200; Resistance: 10 kOhms; Series: ERJ; Size / Dimension: 0.024" L x 0.012" W (0.60mm x 0.30mm); Supplier 1: DigiKey; Supplier Part Number 1: P122414CT-ND; Supplier Device Package: 0201; Tolerance: ±1%
R3 = ERJ-1GNF4991C: RES SMD 4.99K OHM 1% 1/20W 0201; Manufacturer: Panasonic Electronic Components; Power (Watts): 0.05W, 1/20W; Temperature Coefficient: ±200ppm/°C; Part Number: ERJ-1GNF4991C; Value: 4.99 kOhms; ComponentLink1Description: Datasheet; ComponentLink1URL: https://industrial.panasonic.com/cdbs/www-data/pdf/RDA0000/AOA0000C304.pdf; ComponentLink2Description: DigiKey Link; ComponentLink2URL: http://digikey.com/product-detail/en/panasonic-electronic-components/ERJ-1GNF4991C/P123046CT-ND/8343031; Composition: Thick Film; Device Package: 0201 (0603 Metric); Features: Automotive AEC-Q200; Height - Seated (Max): 0.010" (0.26mm); LastUpdated: 21/01/2020 00:04:10; Lifecycle Status: Active; Minimum Order: 1; Number of Terminations: 2; Operating Temperature: -55°C ~ 125°C; Package / Case: 0201 (0603 Metric); Packaging: TapeAndReel; PartId: 4175; Part Status: Active; Price: 0.01; Ratings: AEC-Q200; Resistance: 4.99 kOhms; Series: ERJ; Size / Dimension: 0.024" L x 0.012" W (0.60mm x 0.30mm); Supplier 1: DigiKey; Supplier Part Number 1: P123046CT-ND; Supplier Device Package: 0201; Tolerance: ±1%
R4 = ERJ-1GNF2433C: RES SMD 243K OHM 1% 1/20W 0201; Manufacturer: Panasonic Electronic Components; Power (Watts): 0.05W, 1/20W; Temperature Coefficient: ±200ppm/°C; Part Number: ERJ-1GNF2433C; Value: 243 kOhms; ComponentLink1Description: Datasheet; ComponentLink1URL: https://industrial.panasonic.com/cdbs/www-data/pdf/RDA0000/AOA0000C304.pdf; ComponentLink2Description: DigiKey Link; ComponentLink2URL: http://digikey.com/product-detail/en/panasonic-electronic-components/ERJ-1GNF2433C/P122863CT-ND/8342665; Composition: Thick Film; Device Package: 0201 (0603 Metric); Features: Automotive AEC-Q200; Height - Seated (Max): 0.010" (0.26mm); LastUpdated: 21/01/2020 00:04:11; Lifecycle Status: Active; Minimum Order: 1; Number of Terminations: 2; Operating Temperature: -55°C ~ 125°C; Package / Case: 0201 (0603 Metric); Packaging: TapeAndReel; PartId: 3464; Part Status: Active; Price: 0.01; Ratings: AEC-Q200; Resistance: 243 kOhms; Series: ERJ; Size / Dimension: 0.024" L x 0.012" W (0.60mm x 0.30mm); Supplier 1: DigiKey; Supplier Part Number 1: P122863CT-ND; Supplier Device Package: 0201; Tolerance: ±1%